# Altium schematic sheet GTL3_Inverter.SchDoc
size A
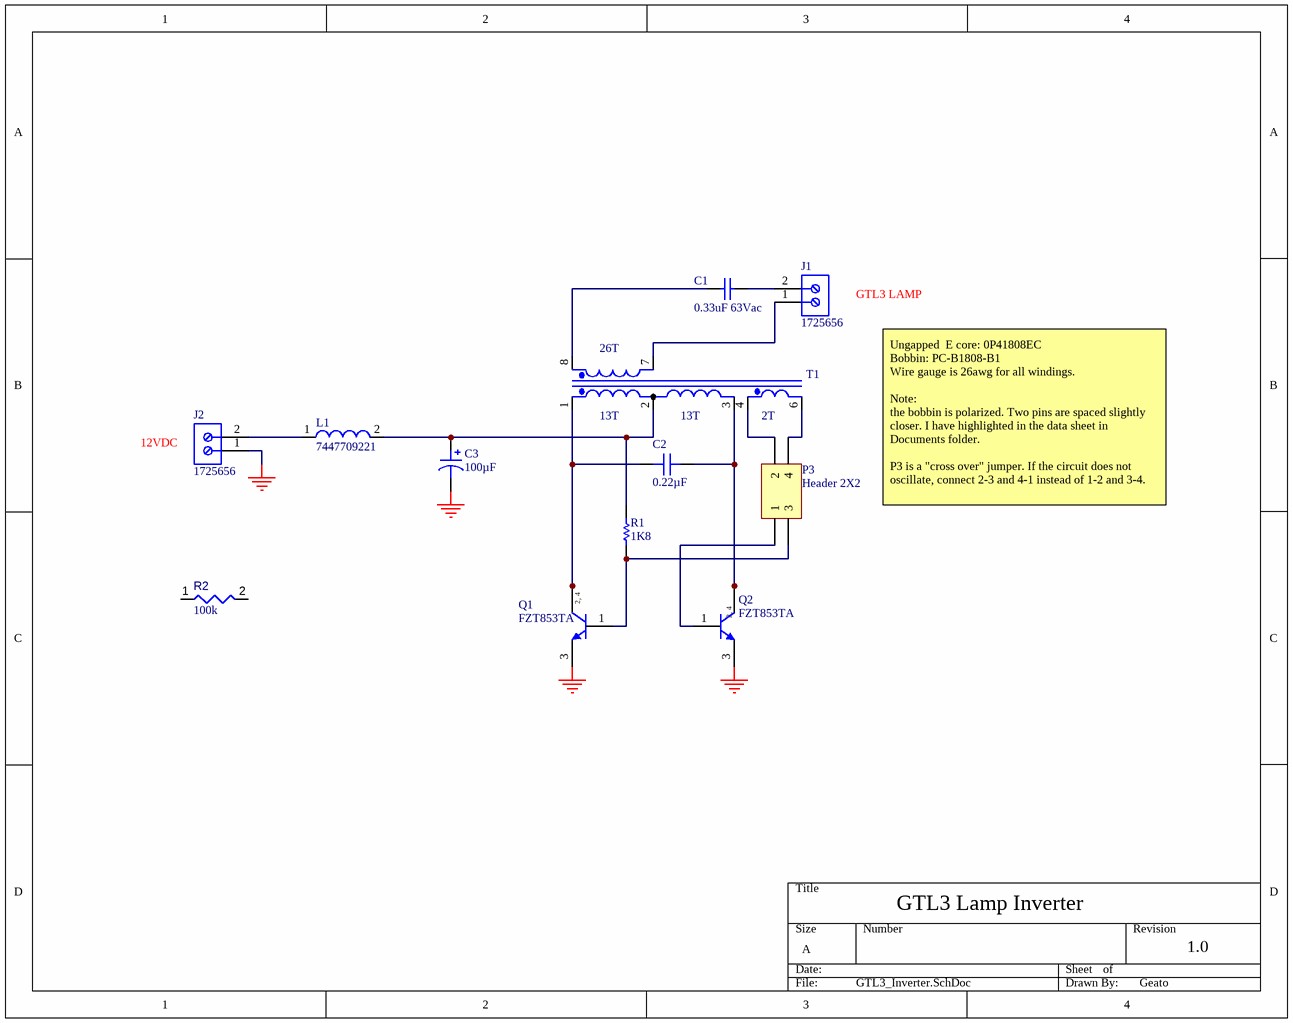
[diagram p0: GTL3_Inverter.SchDoc]

## Parts
C1  0.33uF 63Vac  [CAPC6050X33M]
C2  0.22µF  [CAP FILM 2416]
C3  100µF  [CAP ALSMD 8.3MM H10.5MM]
J1  1725656  [PHOE-1725656-2]
J2  1725656  [PHOE-1725656-2]
L1  7447709221  [WE-PD-XXL]
P3  Header 2X2  [HDR2X2]
Q1  FZT853TA  [DIOD-SOT223-4_V]
Q2  FZT853TA  [DIOD-SOT223-4_V]
R1  1K8  [RESC0805(2012)_L]
R2  value 100k  [RESC1608X55X25ML10T15]  (hidden comment: Resistor 100k +/-1% 0603 100 mW)
T1  Trans5_Royer  [PCB1808B1]  (value not drawn)

## Nets
GND: C3.2 J2.1 Q1.3(E) Q2.3(E)
NetC1_1: C1.1 T1.8(Pri+)
NetC1_2: C1.2 J1.2
NetC2_1: C2.1 Q2.2(C) Q2.4(C) T1.3(Sec2-)
NetC2_2: C2.2 Q1.2(C) Q1.4(C) T1.1(Sec1+)
NetC3_1: C3.1 L1.2 R1.2 T1.2(Sec1-)
NetJ1_1: J1.1 T1.7(Pri-)
NetJ2_2: J2.2 L1.1
NetP3_1: P3.1 Q2.1(B)
NetP3_2: P3.2 T1.4(Sec3+)
NetP3_3: P3.3 Q1.1(B) R1.1
NetP3_4: P3.4 T1.6(Sec3-)

Not connected (* = marked no-connect by the designer): R2 1 2; T1 5

## Notes on the sheet
- GTL3 LAMP
- (near T1) 26T
- (near T1) 13T
- (near T1) 2T
- (near J2) 12VDC
- Ungapped  E core: 0P41808EC
  Bobbin: PC-B1808-B1
  Wire gauge is 26awg for all windings.
  Note:
  the bobbin is polarized. Two pins are spaced slightly closer. I have highlighted in the data sheet in Documents folder.
  P3 is a "cross over" jumper. If the circuit does not oscillate, connect 2-3 and 4-1 instead of 1-2 and 3-4.
- GTL3 Lamp Inverter
- 1.0
- Geato
- (in symbol CMP-2000-06300-1) 2, 4

## Library data of the parts
C1 = CMP-001-00084-1: Film Capacitors 100Vdc 0.33uF 10% AEC-Q200; Voltage Rating (DC): 100V; Voltage Rating (AC): 63V; Dielectric Material: Polyester; Capacitance: 330nF; Width: 0.197inch; Case Code (Metric): 5750; Min Operating Temperature: -55°C; Packaging: Cut Tape; Case/Package: 2220; Case Code (Imperial): 2220; Features: High Temperature; Termination: Solder; Height - Seated (Max): 0.129inch; Length: 0.236inch; Max Operating Temperature: 125°C; Voltage Rating: 100V; Mount: Surface Mount; Tolerance: 10%; REACH SVHC: No SVHC
C2 = ECH-U1H224GX9: CAP FILM 0.22UF 2% 50VDC 2416; Manufacturer: Panasonic Electronic Components; Dielectric Material: Polyphenylene Sulfide (PPS), Metallized - Stacked; Voltage Rating - DC: 50V; Part Number: ECH-U1H224GX9; Applications: General Purpose; Capacitance: 0.22µF; ComponentLink1Description: Datasheet; ComponentLink1URL: http://industrial.panasonic.com/www-cgi/jvcr13pz.cgi?E+PZ+3+ABD0013+ECHU1H224GX9+7+WW; ComponentLink2Description: DigiKey Link; ComponentLink2URL: http://digikey.com/product-detail/en/panasonic-electronic-components/ECH-U1H224GX9/PCF1556CT-ND/1630919; Device Package: 2416 (6041 Metric); Height - Seated (Max): 0.118" (3.00mm); LastUpdated: 21/01/2020 3:58:38 AM; Lifecycle Status: Active; Minimum Order: 1; Mounting Type: Surface Mount; Operating Temperature: -55°C ~ 125°C; Package / Case: 2416 (6041 Metric); Packaging: TapeAndReel; Part Status: Active; Price: 0.48; Series: ECH-U(X); Size / Dimension: 0.236" L x 0.161" W (6.00mm x 4.10mm); Supplier 1: DigiKey; Supplier Part Number 1: PCF1556CT-ND; Termination: Solder Pads; Tolerance: ±2%; Value: 0.22µF
C3 = EDH107M050A9MAA: CAP ALUM SMD 105C 100UF 50VDC; Manufacturer: KEMET; Lifetime @ Temp.: 2000 Hrs @ 105°C; Polarization: Polar; Ripple Current @ High Frequency: 300mA @ 10kHz; Ripple Current @ Low Frequency: 240mA @ 120Hz; Surface Mount Land Size: 0.327" L x 0.327" W (8.30mm x 8.30mm); Tolerance: ±20%; Voltage - Rated: 50V; Part Number: EDH107M050A9MAA; Applications: General Purpose; Capacitance: 100µF; ComponentLink1Description: Datasheet; ComponentLink1URL: https://api.kemet.com/component-edge/download/datasheet/EDH107M050A9MAA.pdf; ComponentLink2Description: DigiKey Link; ComponentLink2URL: http://digikey.com/product-detail/en/kemet/EDH107M050A9MAA/399-18136-1-ND/9354337; Device Package: Radial, Can - SMD; Height - Seated (Max): 0.413" (10.50mm); LastUpdated: 21/01/2020 4:02:50 AM; Lifecycle Status: Active; Minimum Order: 1; Mounting Type: Surface Mount; Operating Temperature: -40°C ~ 105°C; Package / Case: Radial, Can - SMD; Packaging: TapeAndReel; PartId: 7635; Part Status: Active; Price: 0.22; Series: EDH; Size / Dimension: 0.315" Dia (8.00mm); Supplier 1: DigiKey; Supplier Part Number 1: 399-18136-1-ND; Value: 100µF
J1 J2 = CMP-2000-05299-1: Male Header, Pitch 2.54 mm, 1 x 2 Position, Height 9 mm, Tail Length 3.5 mm; Manufacturer: Phoenix Contact; Number of contacts: 2; Content: 250pc(s); Pitch: 2.54mm; Industrial packaging: Yes; Colour: Green; Manufacturer part No.: 1725656; Type: MPT0,5/2-2,54; Datasheet URL: http://datasheet.octopart.com/1725656-Phoenix-Contact-datasheet-5302866.pdf; Manufacturer URL: http://www.phoenixcontact.com/; Datasheet Version: Apr-08
L1 = CMP-0227-00173-1: SMD-Shielded Power Inductor WE-PD, L = 220 µH; AML Part Number: IND-S0011; Inductance: 220 µH; PackageReference: WE-PD-XXL; ComponentLink1URL: http://www.we-online.com; PackageDescription: SMD Inductor, 2-Leads, Body 12.0 x 12.0 mm; ComponentLink2URL: http://www.we-online.de/katalog/media/pdf/7447709221.pdf; DatasheetVersion: ver 1, Oct-2004; ComponentLink2Description: Datasheet; PackageVersion: 2004; ComponentLink1Description: Manufacturer Link; Supplier 1: Digi-Key; Supplier Part Number 1: 732-1696-6-ND
P3 = Header 2X2: Header, 2-Pin, Dual row; LatestRevisionDate: 17-Jul-2002; LatestRevisionNote: Re-released for DXP Platform.; Publisher: Altium Limited
Q1 Q2 = CMP-2000-06300-1: NPN Medium Power Transistor, 100 V, 6 A, -55 to 150 degC, 4-Pin SOT223, RoHS, Tape and Reel; Configuration: Single; Collector- Emitter Voltage VCEO Max: 100V; Brand: DiodesIncorporated; Collector- Base Voltage VCBO: 200V; Collector-Emitter Saturation Voltage: 340mV; Pd - Power Dissipation: 3W; DC Current Gain hFE Max: 100; Maximum DC Collector Current: 10A; Continuous Collector Current: 6A; DC Collector/Base Gain hfe Min: 20at10A,2V; Package Version: 06/2015; Unit Weight: 0.000282oz; Emitter- Base Voltage VEBO: 7V; Gain Bandwidth Product fT: 130MHz; Maximum Operating Temperature: +150C; Package / Case: SOT-223; Mounting Style: SMD/SMT; Width: 3.7mm(Max); Length: 6.7mm(Max); Datasheet Version: Rev. 5-3, 05/2015; Packaging: Reel; RoHS: True; Mounting Technology: SurfaceMount; Factory Pack Quantity: 1000; Transistor Polarity: NPN; Manufacturer: DiodesIncorporated; Package URL: http://www.diodes.com/_files/packages/SOT223.pdf; Manufacturer URL: http://www.diodes.com/; Height: 1.65mm(Max); Package Description: 4-Pin Small Outline Transistor, Body 6.5 x 3.5 mm, Pitch 2.3 mm; Datasheet URL: http://www.diodes.com/_files/datasheets/FZT853.pdf; Product Category: BipolarTransistors-BJT; Package Reference: SOT223-4; Series: FZT853; Minimum Operating Temperature: -55C
R1 = CMP-1013-00537-1: 1K8 0.125W 1% 0805 (2012 Metric)  SMD; AML Part Number: RES-S0005; Case-Metric: 2012; Value: 1800.00 Ohm; Case-EIA: 0805; Power: 0.125 W; Tolerance: 1 %; Technology: SMT
R2 = CMP-009-00023-4: Chip Resistor, 100 KOhm, +/- 1%, 0.1 W, -55 to 155 degC, 0603 (1608 Metric); Power: 100mW; Voltage Rating: 50V; Max Operating Temperature: 155°C; Min Operating Temperature: -55°C; RoHS Compliant: True; Pins: 2; Case/Package: 0603; Mounting Technology: SM; Tolerance: 1%
T1 = Trans5_Royer: Four-winding Transformer (Non-Ideal); Sim Note: Enter the turns ratios, Core loss resistance, Magnetising Reactance, Leakage Reactances and Resistances referred to the primary side into the parameter fields.; Published: 25-Jan-2001; LatestRevisionDate: 17-Jul-2002; LatestRevisionNote: Re-released for DXP Platform.; PackageReference: TRF_8; Publisher: Altium Limited; PackageDescription: Transformer; 8 Leads